# EAGLE design Light-Adapter SMD (EAGLE 9.5.2)
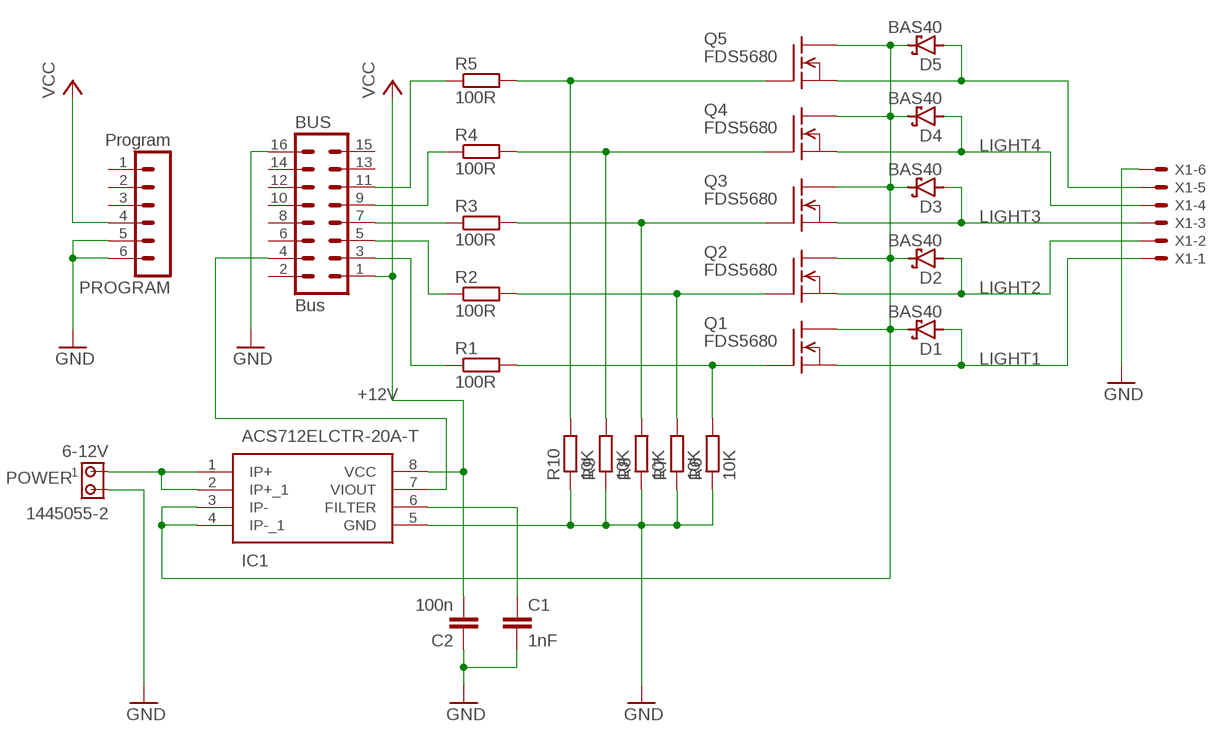
[diagram p0: schematic, sheet 1]

## Parts
6-12V  1445055-2  [1445055-2]
BUS  Bus  MA08-2  [MA08-2]
C1  1nF  C-EUC0402  [C0402]
C2  100n  C-EUC0402  [C0402]
D1  BAS40  [SOT23]
D2  BAS40  [SOT23]
D3  BAS40  [SOT23]
D4  BAS40  [SOT23]
D5  BAS40  [SOT23]
IC1  ACS712ELCTR-20A-T  [SOIC127P600X175-8N]
PROGRAM  Program  MA06-1  [MA06-1]
Q1  FDS5680  [SO-8]
Q2  FDS5680  [SO-8]
Q3  FDS5680  [SO-8]
Q4  FDS5680  [SO-8]
Q5  FDS5680  [SO-8]
R1  100R  R-EU_R0402  [R0402]
R2  100R  R-EU_R0402  [R0402]
R3  100R  R-EU_R0402  [R0402]
R4  100R  R-EU_R0402  [R0402]
R5  100R  R-EU_R0402  [R0402]
R6  10K  R-EU_R0402  [R0402]
R7  10K  R-EU_R0402  [R0402]
R8  10K  R-EU_R0402  [R0402]
R9  10K  R-EU_R0402  [R0402]
R10  10K  R-EU_R0402  [R0402]
X1  22-23-2061  [22-23-2061]

## Nets
+12V: D1.3(C) D2.3(C) D3.3(C) D4.3(C) D5.3(C) IC1.3(IP-) IC1.4(IP-_1) Q1.5(D) Q1.6(D) Q1.7(D) Q1.8(D) Q2.5(D) Q2.6(D) Q2.7(D) Q2.8(D) Q3.5(D) Q3.6(D) Q3.7(D) Q3.8(D) Q4.5(D) Q4.6(D) Q4.7(D) Q4.8(D) Q5.5(D) Q5.6(D) Q5.7(D) Q5.8(D)
GND: 6-12V.2 BUS.16 C1.2 C2.1 IC1.5(GND) PROGRAM.5 PROGRAM.6 R6.1 R7.1 R8.1 R9.1 R10.1 X1.6
LIGHT1: D1.1(A) Q1.1(S) Q1.2(S) Q1.3(S) X1.1
LIGHT2: D2.1(A) Q2.1(S) Q2.2(S) Q2.3(S) X1.2
LIGHT3: D3.1(A) Q3.1(S) Q3.2(S) Q3.3(S) X1.3
LIGHT4: D4.1(A) Q4.1(S) Q4.2(S) Q4.3(S) X1.4
LIGHT5: D5.1(A) Q5.1(S) Q5.2(S) Q5.3(S) X1.5
N$1: BUS.3 R1.1
N$2: BUS.5 R2.1
N$3: BUS.7 R3.1
N$5: BUS.9 R4.1
N$6: BUS.4 IC1.7(VIOUT)
N$7: C1.1 IC1.6(FILTER)
N$10: BUS.11 R5.1
N$11: Q5.4(G) R5.2 R10.2
N$13: Q4.4(G) R4.2 R9.2
N$14: Q3.4(G) R3.2 R8.2
N$15: Q2.4(G) R2.2 R7.2
N$16: Q1.4(G) R1.2 R6.2
POWER: 6-12V.1 IC1.1(IP+) IC1.2(IP+_1)
VCC: BUS.1 C2.2 IC1.8(VCC) PROGRAM.4
Unconnected: BUS.2 BUS.6 BUS.8 BUS.10 BUS.12 BUS.13 BUS.14 BUS.15 PROGRAM.1 PROGRAM.2 PROGRAM.3

## Library data of the parts
6-12V = con-amp:1445055-2: Micro MATE-N-LOK Connectors grid 1.5 mm Source: ENG_CD_1445055_A.pdf
BUS = con-lstb:MA08-2: PIN HEADER; OC_FARNELL: unknown; OC_NEWARK: unknown
C1 C2 = rcl:C-EU: CAPACITOR, European symbol; SPICEPREFIX: C
D1-D5 = diode:BAS40: Silicon Schottky Diodes General-purpose diode for high-speed switching
IC1 = SamacSys_Parts:ACS712ELCTR-20A-T: ACS712ELCTR-20A-T, Hall Effect Sensor 5V 8-Pin SOIC, SOIC N Source: Datasheet <http://uk.rs-online.com/web/p/products/6807135P>; ALLIED_NUMBER: R1076682; DESCRIPTION: ACS712ELCTR-20A-T, Hall Effect Sensor 5V 8-Pin SOIC, SOIC N; HEIGHT: 1.75mm; MANUFACTURER_NAME: Allegro Microsystems; MANUFACTURER_PART_NUMBER: ACS712ELCTR-20A-T; RS_PART_NUMBER: 6807135P; RS_PRICE-STOCK: http://uk.rs-online.com/web/p/products/6807135P
PROGRAM = con-lstb:MA06-1: PIN HEADER; OC_FARNELL: unknown; OC_NEWARK: unknown
Q1-Q5 = transistor-fet:FDS5680: 60V N-Channel PowerTrench TM MOSFET FAIRCHILD FDS5680.pdf
R1-R10 = rcl:R-EU_: RESISTOR, European symbol; SPICEPREFIX: R
X1 = con-molex:22-23-2061: .100" (2.54mm) Center Header - 6 Pin; MF: MOLEX; MPN: 22-23-2061; OC_FARNELL: 1462922; OC_NEWARK: 27C1933

## Board
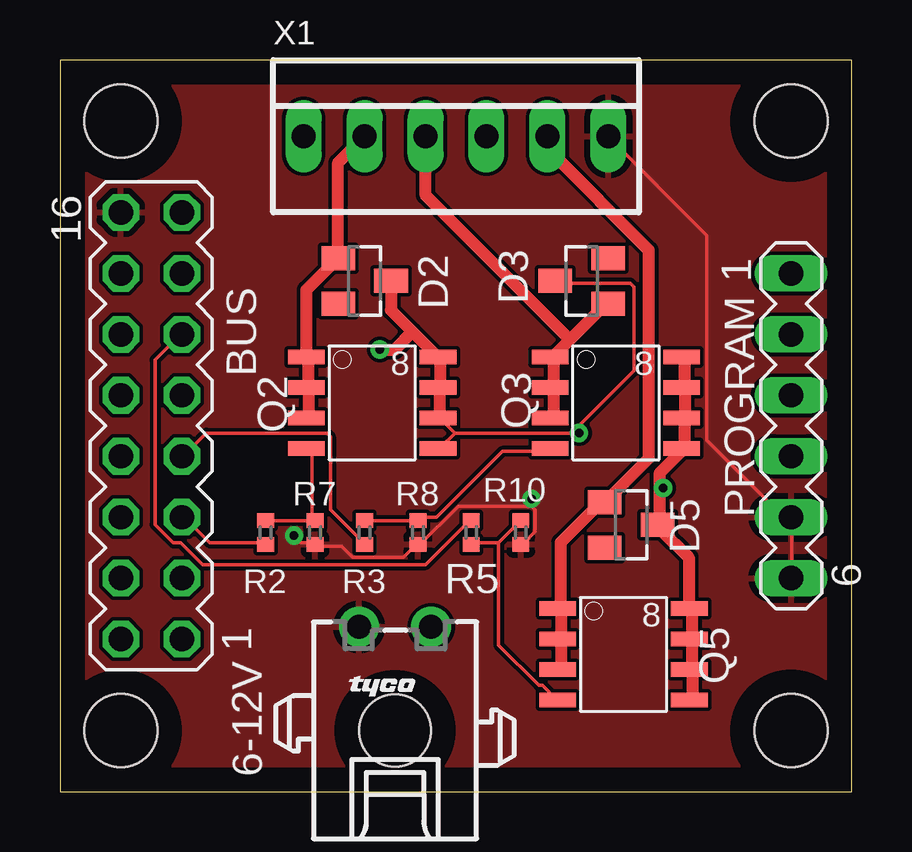
[diagram p1: board, top side]
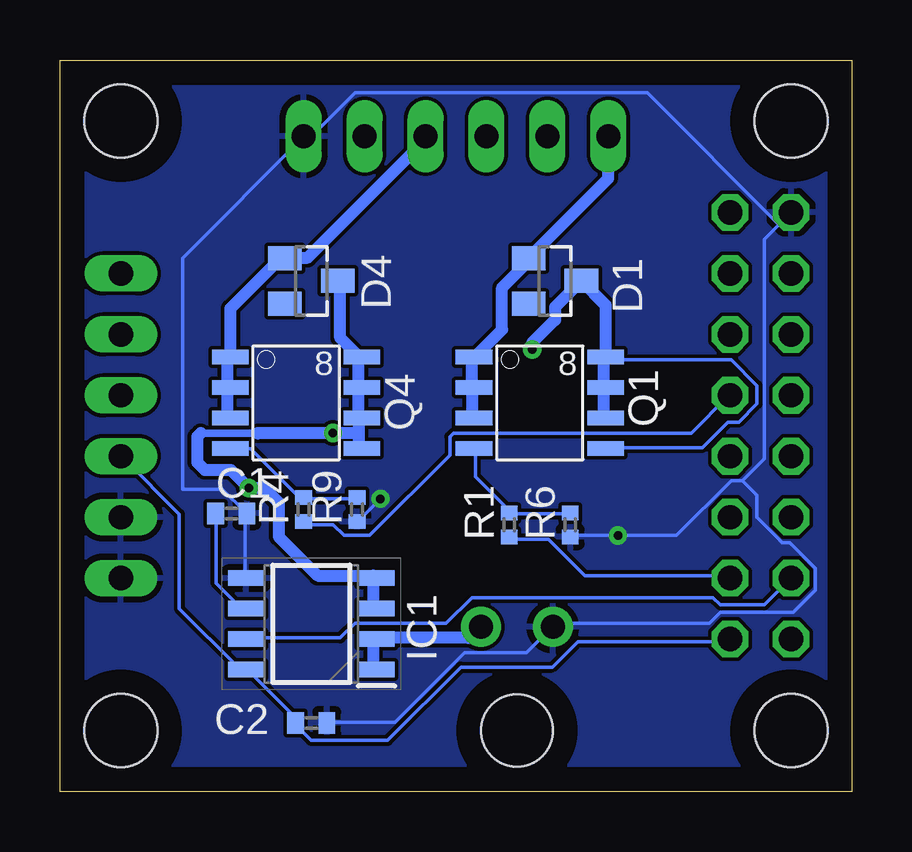
[diagram p2: board, bottom side, seen from below]

Size 33.02 x 30.48 mm. Coordinates in mm from the lower left corner, seen from the top.
Outline: 0,0 33.02,0 33.02,30.48 0,30.47 0,0
Copper layers (1*16): Top 0.035mm / dielectric 1.5mm / Bottom 0.035mm
Design rules "default": minimum track width 6mil, minimum drill 0.35mm, track to track 6mil, track to pad 6mil, pad to pad 6mil, via to via 6mil, smd to smd 6mil, copper to edge 40mil, drill to drill 6mil, minimum pad ring 10mil, minimum via ring 8mil, stop-mask expansion 4mil, vias tented up to drill 0mil, thermal gap 10mil
Holes 3.05 mm at 2.54,2.54 30.48,2.54 30.48,27.94 2.54,27.94

### Footprints (pad centres in the part's own frame; a part is rotated, then mirrored left to right if it is on the bottom)
1445055-2 = drill 1 pad 1.676: 1 1.5,4.32; 2 -1.5,4.32 | hole 3: 0,0
MA08-2 = drill 1.016 octagon: 1 -8.89,-1.27; 2 -8.89,1.27; 3 -6.35,-1.27; 4 -6.35,1.27; 5 -3.81,-1.27; 6 -3.81,1.27; 7 -1.27,-1.27; 8 -1.27,1.27; 9 1.27,-1.27; 10 1.27,1.27; 11 3.81,-1.27; 12 3.81,1.27; 13 6.35,-1.27; 14 6.35,1.27; 15 8.89,-1.27; 16 8.89,1.27
C0402 = smd 0.7 x 0.9: 1 -0.65,0; 2 0.65,0
SOT23 = smd 1 x 1.4: 1 -0.95,-1.1; 2 0.95,-1.1; 3 0,1.1
SOIC127P600X175-8N = smd 1.525 x 0.65: 1 -2.712,1.905; 2 -2.712,0.635; 3 -2.712,-0.635; 4 -2.712,-1.905; 5 2.712,-1.905; 6 2.712,-0.635; 7 2.712,0.635; 8 2.712,1.905
MA06-1 = drill 1.016 long: 1 -6.35,0; 2 -3.81,0; 3 -1.27,0; 4 1.27,0; 5 3.81,0; 6 6.35,0
SO-8 = smd 1.524 x 0.61: 1 -2.743,1.905; 2 -2.743,0.635; 3 -2.743,-0.635; 4 -2.743,-1.905; 5 2.743,-1.905; 6 2.743,-0.635; 7 2.743,0.635; 8 2.743,1.905
R0402 = smd 0.6 x 0.7: 1 -0.5,0; 2 0.5,0
22-23-2061 = drill 1 long: 1 -6.35,0; 2 -3.81,0; 3 -1.27,0; 4 1.27,0; 5 3.81,0; 6 6.35,0

### Placement (x,y rotation side)
6-12V  13.97,2.54 0 top
BUS  3.81,15.24 90 top
C1  25.88,11.59 0 bottom
C2  22.54,2.86 180 bottom
D1  12.38,21.27 270 bottom
D2  12.7,21.27 270 top
D3  21.75,21.27 90 top
D4  22.54,21.27 270 bottom
D5  23.81,11.11 270 top
IC1  22.54,6.99 180 bottom
PROGRAM  30.48,15.24 270 top
Q1  13.02,16.19 0 bottom
Q2  13.02,16.19 0 top
Q3  23.18,16.19 0 top
Q4  23.18,16.19 0 bottom
Q5  23.5,5.71 0 top
R1  14.29,11.11 90 bottom
R2  8.57,10.79 90 top
R3  12.7,10.79 90 top
R4  22.86,11.75 90 bottom
R5  17.14,10.79 270 top
R6  11.75,11.11 90 bottom
R7  10.64,10.79 90 top
R8  14.92,10.79 90 top
R9  20.64,11.75 90 bottom
R10  19.21,10.79 90 top
X1  16.51,27.3 0 top

### Tracks (layer width: path | path; a pad name or v marks a point on that pad's centre or on a via)
+12V  (via drill 0.35)
  Top 0.152: 26.36,3.81 Q5.5 | 26.36,5.03 Q5.6 26.36,5.18 | 26.36,6.25 Q5.7 26.36,6.4 | 26.36,7.62 Q5.8 26.21,7.62 | 26.06,15.7 Q3.6 26.06,15.54 | 26.06,16.76 Q3.7 26.06,16.92 | 26.06,17.98 Q3.8 | 24.99,11.12 D5.3 24.99,10.97 | 25.91,14.17 Q3.5 26.06,14.33 | 21.49,15.09 21.34,14.94 16.46,14.94 | 21.49,15.09 23.93,17.53 23.93,21.04 23.78,21.18 20.73,21.18 D3.3 | 16.46,14.94 15.85,15.54 Q2.6 15.85,15.7 | 16.46,14.94 15.85,14.33 Q2.5 | 15.85,16.76 Q2.7 15.85,16.92 | 21.49,15.09 v21.64,14.94
  Top 0.508: 26.36,5.03 26.36,3.81 | 26.36,5.18 26.36,6.25 | 26.36,6.4 26.36,7.62 | 26.06,16.76 26.06,15.7 | 26.06,16.92 26.06,17.98 | 24.99,12.65 24.99,13.26 25.91,14.17 | 24.99,12.65 24.99,11.12 | 26.06,14.33 26.06,15.54 | 26.21,7.62 26.21,9.75 24.99,10.97 | v25.15,12.65 24.99,12.65 | 15.85,15.7 15.85,16.76 | D2.3 13.8,20.06 14.71,19.15 | 14.71,19.15 Q2.8 15.85,18.01 15.85,16.92 | v13.34,18.41 13.97,18.41 14.71,19.15
  Bottom 0.152: 21.34,21.18 D4.3 | 20.57,18.14 Q4.8 20.57,17.98 | 19.96,7.62 IC1.3 | 19.96,8.84 IC1.4 19.96,8.99 | 20.57,14.33 Q4.5 | 20.57,15.54 Q4.6 20.57,15.7 | 20.57,16.76 Q4.7 20.57,16.92 | 10.36,15.7 Q1.6 | 10.36,16.76 Q1.7 10.36,16.92 | Q1.5 10.21,14.33 6.25,14.33 5.18,15.39 4.72,15.39 3.96,16.15 3.96,16.92 5.03,17.98 10.21,17.98 Q1.8 10.36,17.98
  Bottom 0.305: 24.75,14.94 27.15,14.94
  Bottom 0.508: 21.34,21.18 21.34,18.9 20.57,18.14 | 19.96,8.84 19.96,7.62 | 20.57,15.54 20.57,14.94 | 20.57,14.94 20.57,14.33 | 20.57,15.7 20.57,16.76 | 19.96,8.99 22.28,8.99 23.9,10.62 23.9,12.04 24.51,12.65 v25.15,12.65 25.89,13.4 26.98,13.4 27.29,13.71 27.29,14.79 27.15,14.94 | 20.57,14.94 v21.64,14.94 24.76,14.94 24.77,14.92 24.75,14.94 | 20.57,16.92 20.57,17.98 | 10.36,16.76 10.36,15.7 | 10.36,17.98 10.36,16.92 | Q1.8 10.27,20.26 D1.3 12.38,20.18 12.38,19.65 13.34,18.7 v13.34,18.41
GND  (via drill 0.35)
  Top 0.152: PROGRAM.6 30.5,8.91 30.5,11.4 PROGRAM.5 30.18,11.43 26.98,14.63 26.98,23.16 22.86,27.28 X1.6 | 19.66,11.89 19.81,11.73 19.81,10.82 19.36,10.36 R10.1 | 19.66,11.89 16.61,11.89 14.94,10.21 R8.1 14.78,10.21 14.33,9.75 12.19,9.75 11.73,10.21 10.67,10.21 R7.1 10.52,10.36 10.06,10.36 v9.75,10.67 | 19.66,11.89 v19.66,12.19
  Bottom 0.152: IC1.5 25.3,8.99 25.3,11.58 C1.2 25.31,11.59 25.31,11.65 26.26,12.61 27.91,12.61 27.91,22.23 22.86,27.28 X1.6 22.86,27.43 22.4,27.43 20.73,29.11 8.53,29.11 3.05,23.62 | C2.1 21.79,2.9 19.05,2.9 16.15,5.79 13.56,5.79 12.5,6.86 6-12V.2 12.34,7.01 5.94,7.01 5.49,7.47 2.44,7.47 1.52,8.38 1.52,9.3 2.59,10.36 2.9,10.36 3.96,11.43 3.96,12.34 4.57,12.95 | v19.66,12.19 20.57,11.28 R9.1 | 4.57,12.95 5.03,12.95 7.32,10.67 v9.75,10.67 11.73,10.67 R6.1 | 4.57,12.95 3.66,13.87 3.66,23.01 3.05,23.62 | BUS.16 3.05,23.62
  pour Bottom: 0,30.48 33.02,30.48 33.02,0 0,0
  pour Top: 0,30.48 33.02,30.48 33.02,0 0,0
LIGHT1
  Bottom 0.152: 15.85,15.7 Q1.3 | 15.85,16.76 Q1.2 15.85,16.92 | 15.85,17.98 Q1.1
  Bottom 0.508: 15.85,16.76 15.85,15.7 | 15.85,16.92 15.85,17.98 | X1.1 10.16,25.55 D1.1 13.48,22.1 14.59,20.99 14.59,19.24 15.73,18.1 Q1.1
LIGHT2
  Top 0.152: 10.36,15.7 Q2.3 | 10.36,16.76 Q2.2 10.36,16.92 | 10.36,17.98 Q2.1
  Top 0.508: 10.36,16.76 10.36,15.7 | 10.36,16.92 10.36,17.98 | Q2.1 10.27,20.9 D2.1 11.6,26.2 X1.2
LIGHT3
  Top 0.152: 20.57,15.7 Q3.3 | 20.57,16.76 Q3.2 20.57,16.92 | 20.57,18.14 Q3.1 20.57,17.98
  Top 0.508: 20.57,16.76 20.57,15.7 | 20.57,18.14 21.26,18.82 | 21.26,18.82 22.71,20.27 D3.1 | 20.57,17.98 20.57,16.92 | X1.3 15.24,24.84 21.26,18.82
LIGHT4
  Bottom 0.152: 26.06,15.7 Q4.3 | 26.06,16.76 Q4.2 26.06,16.92 | 25.91,18.14 Q4.1 26.06,17.98 | 23.62,22.25 D4.1
  Bottom 0.508: 26.06,16.76 26.06,15.7 | D4.1 23.82,22.22 25.91,20.14 25.91,18.14 | 26.06,17.98 26.06,16.92 | X1.4 17.78,27.16 22.69,22.25 23.62,22.25
LIGHT5
  Top 0.152: 20.88,5.18 Q5.3 | 20.88,6.25 Q5.2 20.88,6.4 | 20.88,7.62 Q5.1 | 22.86,12.19 D5.1
  Top 0.508: 20.88,6.25 20.88,5.18 | D5.1 22.56,12.06 20.88,10.38 20.88,7.62 20.88,6.4 | 22.86,12.19 24.55,13.88 24.55,22.56 20.42,26.69 20.42,27.28 X1.5
N$1
  Bottom 0.152: R1.1 14.17,10.52 12.65,10.52 11.12,8.99 5.18,8.99 BUS.3
N$2
  Top 0.152: R2.1 8.53,10.36 6.25,10.36 5.18,11.43 BUS.5
N$3
  Top 0.152: R3.1 12.65,10.36 11.28,11.73 11.28,14.78 11.12,14.94 6.1,14.94 5.18,14.02 BUS.7
N$5
  Bottom 0.152: R4.1 22.86,11.12 21.64,11.12 21.18,10.67 20.12,10.67 16.76,14.02 16.76,14.78 16.61,14.94 6.71,14.94 5.18,16.46 BUS.9
N$6
  Bottom 0.152: BUS.4 3.66,7.77 5.49,7.77 5.79,8.08 15.85,8.08 16.92,7.01 20.73,7.01 21.34,6.4 25.15,6.4 IC1.7
N$7
  Bottom 0.152: IC1.6 25.45,7.62 26.52,8.69 26.52,11.58 C1.1
N$10
  Top 0.152: R5.1 17.07,11.28 15.24,9.45 5.94,9.45 5.03,10.36 4.72,10.36 3.96,11.12 3.96,17.98 5.03,19.05 BUS.11
N$11
  Top 0.152: 18.29,10.36 17.22,10.36 R5.2 | 18.29,10.36 19.2,11.28 R10.2 | 18.29,10.36 18.29,6.1 19.96,4.42 20.12,4.42 20.73,3.81 Q5.4
N$13
  Bottom 0.152: R9.2 20.73,12.19 22.86,12.19 R4.2 22.86,12.34 23.13,12.34 25.08,14.29 Q4.4
N$14
  Top 0.152: R3.2 12.8,11.28 14.78,11.28 R8.2 14.94,11.43 15.7,11.43 18.44,14.17 20.42,14.17 Q3.4
N$15
  Top 0.152: R2.2 8.69,11.28 10.52,11.28 R7.2 10.52,11.43 10.52,14.02 10.36,14.17 Q2.4
N$16
  Bottom 0.152: R6.2 11.89,11.58 14.17,11.58 R1.2 14.33,11.73 15.7,13.11 15.7,14.17 Q1.4
POWER
  Bottom 0.152: 19.96,5.18 IC1.1 | 19.96,6.25 IC1.2 19.81,6.4
  Bottom 0.508: 19.96,6.25 19.96,5.18 | 19.81,6.4 16,6.4 15.54,6.86 6-12V.1
VCC
  Bottom 0.152: PROGRAM.4 30.38,13.87 30.35,13.87 28.04,11.56 28.04,7.62 25.6,5.18 25.3,5.18 IC1.8 25.15,5.03 23.32,3.2 23.32,2.9 C2.2 23.16,2.74 22.55,2.13 19.36,2.13 16.31,5.18 12.5,5.18 11.43,6.25 5.18,6.25 BUS.1